# Altium schematic sheet 10x15 Matrix.SchDoc
size B
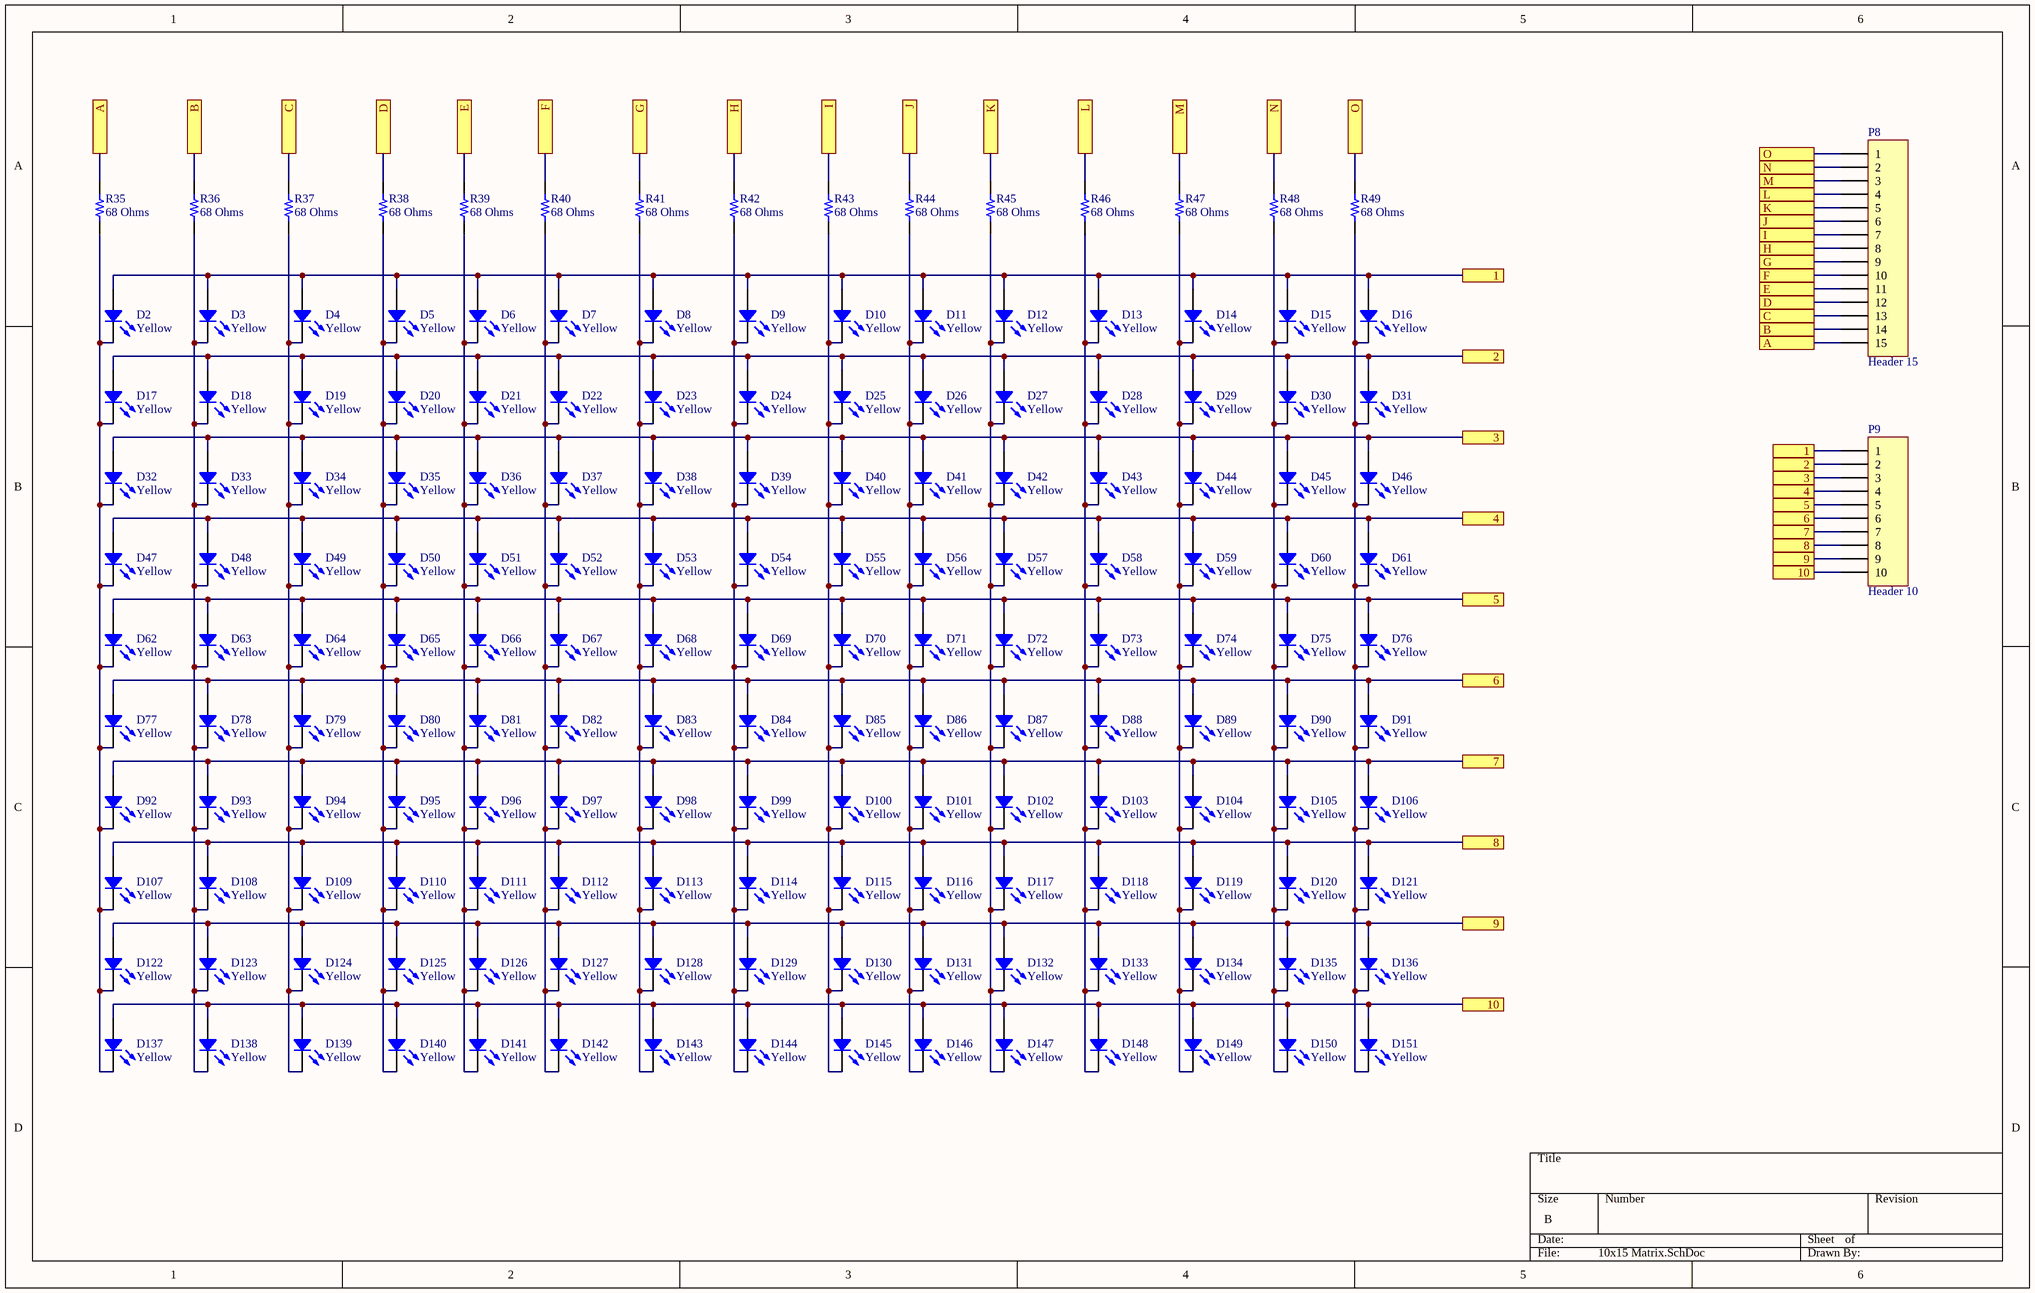
[diagram p0: 10x15 Matrix.SchDoc]

## Parts
D2  Yellow  [LED 0805_2012 YELLOW]
D3  Yellow  [LED 0805_2012 YELLOW]
D4  Yellow  [LED 0805_2012 YELLOW]
D5  Yellow  [LED 0805_2012 YELLOW]
D6  Yellow  [LED 0805_2012 YELLOW]
D7  Yellow  [LED 0805_2012 YELLOW]
D8  Yellow  [LED 0805_2012 YELLOW]
D9  Yellow  [LED 0805_2012 YELLOW]
D10  Yellow  [LED 0805_2012 YELLOW]
D11  Yellow  [LED 0805_2012 YELLOW]
D12  Yellow  [LED 0805_2012 YELLOW]
D13  Yellow  [LED 0805_2012 YELLOW]
D14  Yellow  [LED 0805_2012 YELLOW]
D15  Yellow  [LED 0805_2012 YELLOW]
D16  Yellow  [LED 0805_2012 YELLOW]
D17  Yellow  [LED 0805_2012 YELLOW]
D18  Yellow  [LED 0805_2012 YELLOW]
D19  Yellow  [LED 0805_2012 YELLOW]
D20  Yellow  [LED 0805_2012 YELLOW]
D21  Yellow  [LED 0805_2012 YELLOW]
D22  Yellow  [LED 0805_2012 YELLOW]
D23  Yellow  [LED 0805_2012 YELLOW]
D24  Yellow  [LED 0805_2012 YELLOW]
D25  Yellow  [LED 0805_2012 YELLOW]
D26  Yellow  [LED 0805_2012 YELLOW]
D27  Yellow  [LED 0805_2012 YELLOW]
D28  Yellow  [LED 0805_2012 YELLOW]
D29  Yellow  [LED 0805_2012 YELLOW]
D30  Yellow  [LED 0805_2012 YELLOW]
D31  Yellow  [LED 0805_2012 YELLOW]
D32  Yellow  [LED 0805_2012 YELLOW]
D33  Yellow  [LED 0805_2012 YELLOW]
D34  Yellow  [LED 0805_2012 YELLOW]
D35  Yellow  [LED 0805_2012 YELLOW]
D36  Yellow  [LED 0805_2012 YELLOW]
D37  Yellow  [LED 0805_2012 YELLOW]
D38  Yellow  [LED 0805_2012 YELLOW]
D39  Yellow  [LED 0805_2012 YELLOW]
D40  Yellow  [LED 0805_2012 YELLOW]
D41  Yellow  [LED 0805_2012 YELLOW]
D42  Yellow  [LED 0805_2012 YELLOW]
D43  Yellow  [LED 0805_2012 YELLOW]
D44  Yellow  [LED 0805_2012 YELLOW]
D45  Yellow  [LED 0805_2012 YELLOW]
D46  Yellow  [LED 0805_2012 YELLOW]
D47  Yellow  [LED 0805_2012 YELLOW]
D48  Yellow  [LED 0805_2012 YELLOW]
D49  Yellow  [LED 0805_2012 YELLOW]
D50  Yellow  [LED 0805_2012 YELLOW]
D51  Yellow  [LED 0805_2012 YELLOW]
D52  Yellow  [LED 0805_2012 YELLOW]
D53  Yellow  [LED 0805_2012 YELLOW]
D54  Yellow  [LED 0805_2012 YELLOW]
D55  Yellow  [LED 0805_2012 YELLOW]
D56  Yellow  [LED 0805_2012 YELLOW]
D57  Yellow  [LED 0805_2012 YELLOW]
D58  Yellow  [LED 0805_2012 YELLOW]
D59  Yellow  [LED 0805_2012 YELLOW]
D60  Yellow  [LED 0805_2012 YELLOW]
D61  Yellow  [LED 0805_2012 YELLOW]
D62  Yellow  [LED 0805_2012 YELLOW]
D63  Yellow  [LED 0805_2012 YELLOW]
D64  Yellow  [LED 0805_2012 YELLOW]
D65  Yellow  [LED 0805_2012 YELLOW]
D66  Yellow  [LED 0805_2012 YELLOW]
D67  Yellow  [LED 0805_2012 YELLOW]
D68  Yellow  [LED 0805_2012 YELLOW]
D69  Yellow  [LED 0805_2012 YELLOW]
D70  Yellow  [LED 0805_2012 YELLOW]
D71  Yellow  [LED 0805_2012 YELLOW]
D72  Yellow  [LED 0805_2012 YELLOW]
D73  Yellow  [LED 0805_2012 YELLOW]
D74  Yellow  [LED 0805_2012 YELLOW]
D75  Yellow  [LED 0805_2012 YELLOW]
D76  Yellow  [LED 0805_2012 YELLOW]
D77  Yellow  [LED 0805_2012 YELLOW]
D78  Yellow  [LED 0805_2012 YELLOW]
D79  Yellow  [LED 0805_2012 YELLOW]
D80  Yellow  [LED 0805_2012 YELLOW]
D81  Yellow  [LED 0805_2012 YELLOW]
D82  Yellow  [LED 0805_2012 YELLOW]
D83  Yellow  [LED 0805_2012 YELLOW]
D84  Yellow  [LED 0805_2012 YELLOW]
D85  Yellow  [LED 0805_2012 YELLOW]
D86  Yellow  [LED 0805_2012 YELLOW]
D87  Yellow  [LED 0805_2012 YELLOW]
D88  Yellow  [LED 0805_2012 YELLOW]
D89  Yellow  [LED 0805_2012 YELLOW]
D90  Yellow  [LED 0805_2012 YELLOW]
D91  Yellow  [LED 0805_2012 YELLOW]
D92  Yellow  [LED 0805_2012 YELLOW]
D93  Yellow  [LED 0805_2012 YELLOW]
D94  Yellow  [LED 0805_2012 YELLOW]
D95  Yellow  [LED 0805_2012 YELLOW]
D96  Yellow  [LED 0805_2012 YELLOW]
D97  Yellow  [LED 0805_2012 YELLOW]
D98  Yellow  [LED 0805_2012 YELLOW]
D99  Yellow  [LED 0805_2012 YELLOW]
D100  Yellow  [LED 0805_2012 YELLOW]
D101  Yellow  [LED 0805_2012 YELLOW]
D102  Yellow  [LED 0805_2012 YELLOW]
D103  Yellow  [LED 0805_2012 YELLOW]
D104  Yellow  [LED 0805_2012 YELLOW]
D105  Yellow  [LED 0805_2012 YELLOW]
D106  Yellow  [LED 0805_2012 YELLOW]
D107  Yellow  [LED 0805_2012 YELLOW]
D108  Yellow  [LED 0805_2012 YELLOW]
D109  Yellow  [LED 0805_2012 YELLOW]
D110  Yellow  [LED 0805_2012 YELLOW]
D111  Yellow  [LED 0805_2012 YELLOW]
D112  Yellow  [LED 0805_2012 YELLOW]
D113  Yellow  [LED 0805_2012 YELLOW]
D114  Yellow  [LED 0805_2012 YELLOW]
D115  Yellow  [LED 0805_2012 YELLOW]
D116  Yellow  [LED 0805_2012 YELLOW]
D117  Yellow  [LED 0805_2012 YELLOW]
D118  Yellow  [LED 0805_2012 YELLOW]
D119  Yellow  [LED 0805_2012 YELLOW]
D120  Yellow  [LED 0805_2012 YELLOW]
D121  Yellow  [LED 0805_2012 YELLOW]
D122  Yellow  [LED 0805_2012 YELLOW]
D123  Yellow  [LED 0805_2012 YELLOW]
D124  Yellow  [LED 0805_2012 YELLOW]
D125  Yellow  [LED 0805_2012 YELLOW]
D126  Yellow  [LED 0805_2012 YELLOW]
D127  Yellow  [LED 0805_2012 YELLOW]
D128  Yellow  [LED 0805_2012 YELLOW]
D129  Yellow  [LED 0805_2012 YELLOW]
D130  Yellow  [LED 0805_2012 YELLOW]
D131  Yellow  [LED 0805_2012 YELLOW]
D132  Yellow  [LED 0805_2012 YELLOW]
D133  Yellow  [LED 0805_2012 YELLOW]
D134  Yellow  [LED 0805_2012 YELLOW]
D135  Yellow  [LED 0805_2012 YELLOW]
D136  Yellow  [LED 0805_2012 YELLOW]
D137  Yellow  [LED 0805_2012 YELLOW]
D138  Yellow  [LED 0805_2012 YELLOW]
D139  Yellow  [LED 0805_2012 YELLOW]
D140  Yellow  [LED 0805_2012 YELLOW]
D141  Yellow  [LED 0805_2012 YELLOW]
D142  Yellow  [LED 0805_2012 YELLOW]
D143  Yellow  [LED 0805_2012 YELLOW]
D144  Yellow  [LED 0805_2012 YELLOW]
D145  Yellow  [LED 0805_2012 YELLOW]
D146  Yellow  [LED 0805_2012 YELLOW]
D147  Yellow  [LED 0805_2012 YELLOW]
D148  Yellow  [LED 0805_2012 YELLOW]
D149  Yellow  [LED 0805_2012 YELLOW]
D150  Yellow  [LED 0805_2012 YELLOW]
D151  Yellow  [LED 0805_2012 YELLOW]
P8  Header 15  [HDR1X15]
P9  Header 10  [HDR1X10]
R35  68 Ohms  [RES 0603_1608]
R36  68 Ohms  [RES 0603_1608]
R37  68 Ohms  [RES 0603_1608]
R38  68 Ohms  [RES 0603_1608]
R39  68 Ohms  [RES 0603_1608]
R40  68 Ohms  [RES 0603_1608]
R41  68 Ohms  [RES 0603_1608]
R42  68 Ohms  [RES 0603_1608]
R43  68 Ohms  [RES 0603_1608]
R44  68 Ohms  [RES 0603_1608]
R45  68 Ohms  [RES 0603_1608]
R46  68 Ohms  [RES 0603_1608]
R47  68 Ohms  [RES 0603_1608]
R48  68 Ohms  [RES 0603_1608]
R49  68 Ohms  [RES 0603_1608]

## Ports
1, 2, 3, 4, 5, 6, 7, 8, 9, 10, A, B, C, D, E, F, G, H, I, J, K, L, M, N, O

## Nets
1: D2.1 D3.1 D4.1 D5.1 D6.1 D7.1 D8.1 D9.1 D10.1 D11.1 D12.1 D13.1 D14.1 D15.1 D16.1 P9.1 ; port 1
2: D17.1 D18.1 D19.1 D20.1 D21.1 D22.1 D23.1 D24.1 D25.1 D26.1 D27.1 D28.1 D29.1 D30.1 D31.1 P9.2 ; port 2
3: D32.1 D33.1 D34.1 D35.1 D36.1 D37.1 D38.1 D39.1 D40.1 D41.1 D42.1 D43.1 D44.1 D45.1 D46.1 P9.3 ; port 3
4: D47.1 D48.1 D49.1 D50.1 D51.1 D52.1 D53.1 D54.1 D55.1 D56.1 D57.1 D58.1 D59.1 D60.1 D61.1 P9.4 ; port 4
5: D62.1 D63.1 D64.1 D65.1 D66.1 D67.1 D68.1 D69.1 D70.1 D71.1 D72.1 D73.1 D74.1 D75.1 D76.1 P9.5 ; port 5
6: D77.1 D78.1 D79.1 D80.1 D81.1 D82.1 D83.1 D84.1 D85.1 D86.1 D87.1 D88.1 D89.1 D90.1 D91.1 P9.6 ; port 6
7: D92.1 D93.1 D94.1 D95.1 D96.1 D97.1 D98.1 D99.1 D100.1 D101.1 D102.1 D103.1 D104.1 D105.1 D106.1 P9.7 ; port 7
8: D107.1 D108.1 D109.1 D110.1 D111.1 D112.1 D113.1 D114.1 D115.1 D116.1 D117.1 D118.1 D119.1 D120.1 D121.1 P9.8 ; port 8
9: D122.1 D123.1 D124.1 D125.1 D126.1 D127.1 D128.1 D129.1 D130.1 D131.1 D132.1 D133.1 D134.1 D135.1 D136.1 P9.9 ; port 9
10: D137.1 D138.1 D139.1 D140.1 D141.1 D142.1 D143.1 D144.1 D145.1 D146.1 D147.1 D148.1 D149.1 D150.1 D151.1 P9.10 ; port 10
A: P8.15 R35.2 ; port A
B: P8.14 R36.2 ; port B
C: P8.13 R37.2 ; port C
D: P8.12 R38.2 ; port D
E: P8.11 R39.2 ; port E
F: P8.10 R40.2 ; port F
G: P8.9 R41.2 ; port G
H: P8.8 R42.2 ; port H
I: P8.7 R43.2 ; port I
J: P8.6 R44.2 ; port J
K: P8.5 R45.2 ; port K
L: P8.4 R46.2 ; port L
M: P8.3 R47.2 ; port M
N: P8.2 R48.2 ; port N
O: P8.1 R49.2 ; port O
NetD2_2: D2.2 D17.2 D32.2 D47.2 D62.2 D77.2 D92.2 D107.2 D122.2 D137.2 R35.1
NetD3_2: D3.2 D18.2 D33.2 D48.2 D63.2 D78.2 D93.2 D108.2 D123.2 D138.2 R36.1
NetD4_2: D4.2 D19.2 D34.2 D49.2 D64.2 D79.2 D94.2 D109.2 D124.2 D139.2 R37.1
NetD5_2: D5.2 D20.2 D35.2 D50.2 D65.2 D80.2 D95.2 D110.2 D125.2 D140.2 R38.1
NetD6_2: D6.2 D21.2 D36.2 D51.2 D66.2 D81.2 D96.2 D111.2 D126.2 D141.2 R39.1
NetD7_2: D7.2 D22.2 D37.2 D52.2 D67.2 D82.2 D97.2 D112.2 D127.2 D142.2 R40.1
NetD8_2: D8.2 D23.2 D38.2 D53.2 D68.2 D83.2 D98.2 D113.2 D128.2 D143.2 R41.1
NetD9_2: D9.2 D24.2 D39.2 D54.2 D69.2 D84.2 D99.2 D114.2 D129.2 D144.2 R42.1
NetD10_2: D10.2 D25.2 D40.2 D55.2 D70.2 D85.2 D100.2 D115.2 D130.2 D145.2 R43.1
NetD11_2: D11.2 D26.2 D41.2 D56.2 D71.2 D86.2 D101.2 D116.2 D131.2 D146.2 R44.1
NetD12_2: D12.2 D27.2 D42.2 D57.2 D72.2 D87.2 D102.2 D117.2 D132.2 D147.2 R45.1
NetD13_2: D13.2 D28.2 D43.2 D58.2 D73.2 D88.2 D103.2 D118.2 D133.2 D148.2 R46.1
NetD14_2: D14.2 D29.2 D44.2 D59.2 D74.2 D89.2 D104.2 D119.2 D134.2 D149.2 R47.1
NetD15_2: D15.2 D30.2 D45.2 D60.2 D75.2 D90.2 D105.2 D120.2 D135.2 D150.2 R48.1
NetD16_2: D16.2 D31.2 D46.2 D61.2 D76.2 D91.2 D106.2 D121.2 D136.2 D151.2 R49.1

## Library data of the parts
D2-D151 = SML-LX0805YC-TR: LED YELLOW CLEAR SMD; Manufacturer: Lumex Opto/Components Inc.; Configuration: Standard; Current - Test: 20mA; Lens Color: Colorless; Lens Size: 1.40mm x 1.25mm; Lens Style: Rectangle with Flat Top; Millicandela Rating: 9mcd; Viewing Angle: 140°; Voltage - Forward (Vf) (Typ): 2.1V; Wavelength - Peak: 585nm; Part Number: SML-LX0805YC-TR; Color: Yellow; ComponentLink1Description: Datasheet; ComponentLink1URL: https://www.lumex.com/content/files/ProductAttachment/SML-LX0805YC-TR.pdf; ComponentLink2Description: DigiKey Link; ComponentLink2URL: http://digikey.com/product-detail/en/lumex-opto-components-inc/SML-LX0805YC-TR/67-2192-1-ND/4172836; Device Package: 0805 (2012 Metric); Height (Max): 1.20mm; LastUpdated: 9/2/2020 1:21:22 AM; Lens Transparency: Clear; Lifecycle Status: Active; Minimum Order: 1; Mounting Type: Surface Mount; Package / Case: 0805 (2012 Metric); Packaging: TapeAndReel; PartId: 39; Part Status: Active; Price: 0.06; Series: -; Size / Dimension: 2.00mm L x 1.25mm W; Supplier 1: DigiKey; Supplier Part Number 1: 67-2192-1-ND; Value: Yellow
P8 = Header 15: Header, 15-Pin; LatestRevisionDate: 17-Jul-2002; LatestRevisionNote: Re-released for DXP Platform.; Publisher: Altium Limited
P9 = Header 10: Header, 10-Pin; LatestRevisionDate: 17-Jul-2002; LatestRevisionNote: Re-released for DXP Platform.; Publisher: Altium Limited
R35-R49 = CRGCQ0603J68R: CRGCQ 0603 68R 5%; Manufacturer: TE Connectivity Passive Product; Power (Watts): 0.1W, 1/10W; Temperature Coefficient: ±200ppm/°C; Part Number: CRGCQ0603J68R; Value: 68 Ohms; ComponentLink1Description: Datasheet; ComponentLink1URL: https://www.te.com/commerce/DocumentDelivery/DDEController?Action=srchrtrv&DocNm=1773204-3&DocType=DS&DocLang=English; ComponentLink2Description: DigiKey Link; ComponentLink2URL: http://digikey.com/product-detail/en/te-connectivity-passive-product/CRGCQ0603J68R/A130084CT-ND/8577916; Composition: Thick Film; Device Package: 0603 (1608 Metric); Features: Automotive AEC-Q200, Moisture Resistant; Height - Seated (Max): 0.022" (0.55mm); LastUpdated: 9/2/2020 1:10:07 AM; Lifecycle Status: Active; Minimum Order: 1; Number of Terminations: 2; Operating Temperature: -55°C ~ 155°C; Package / Case: 0603 (1608 Metric); Packaging: CutTape; PartId: 13186; Part Status: Active; Price: 0.10; Ratings: AEC-Q200; Resistance: 68 Ohms; Series: CRGCQ; Size / Dimension: 0.063" L x 0.031" W (1.60mm x 0.80mm); Supplier 1: DigiKey; Supplier Part Number 1: A130084CT-ND; Supplier Device Package: 0603; Tolerance: ±5%